# Altium schematic sheet MCU.SchDoc
size A2; SheetNumber: 3; SheetTotal: 12
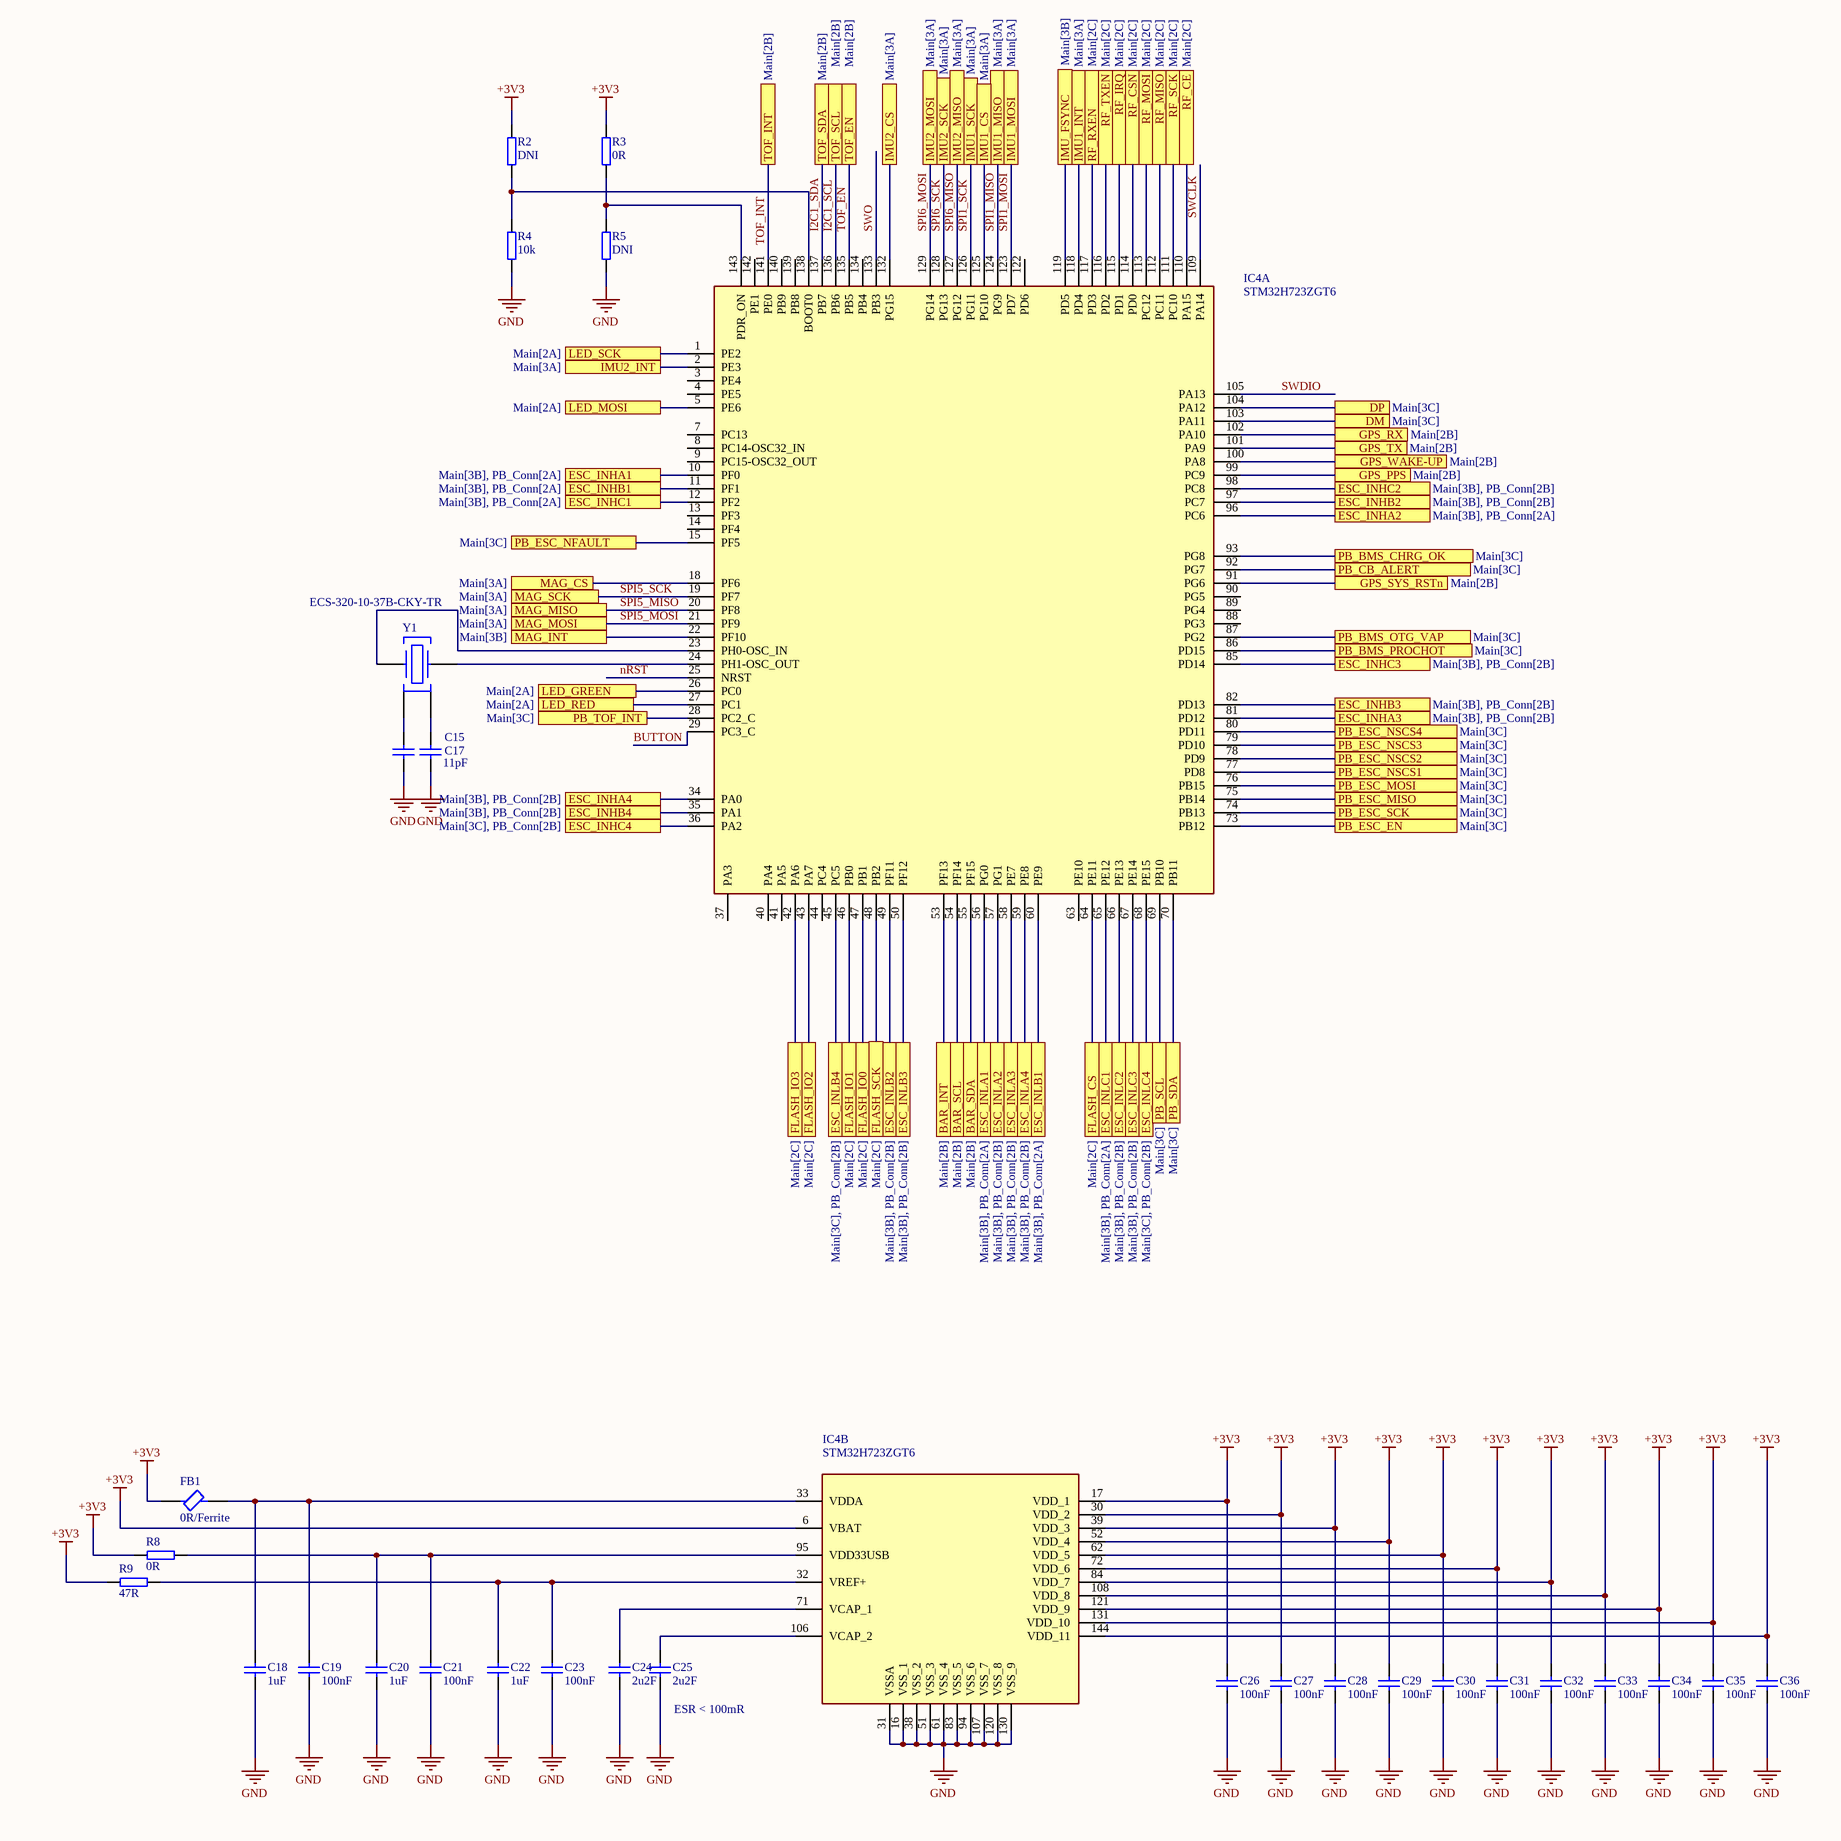
[diagram p0: MCU.SchDoc, left]
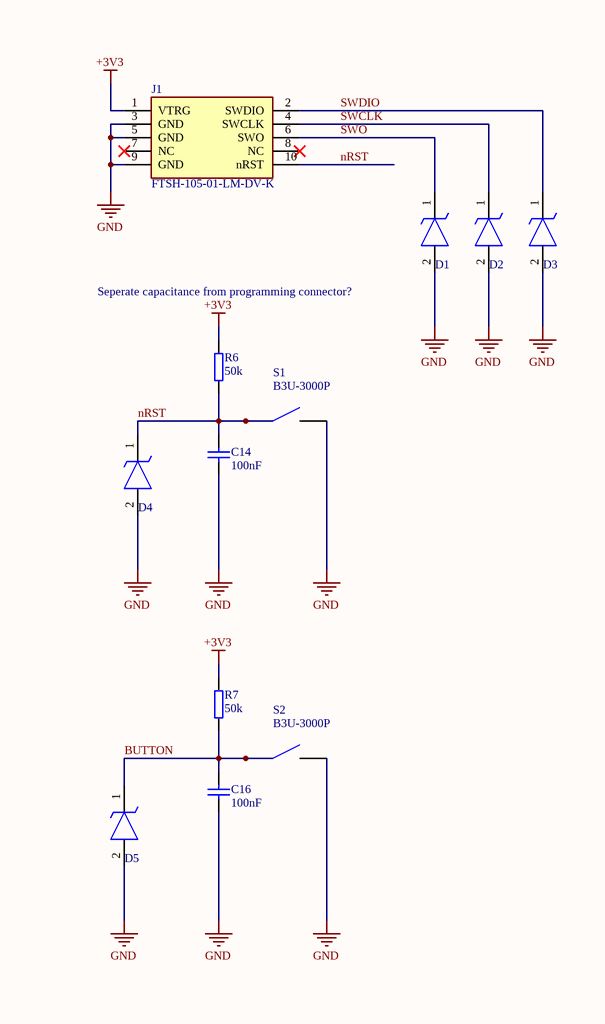
[diagram p1: MCU.SchDoc, right]

## Parts
C14  value 100nF  [CAP0402]  (hidden comment: Cap0402)
C15  Cap0402  [CAP0402]  (value not drawn)
C16  value 100nF  [CAP0402]  (hidden comment: Cap0402)
C17  value 11pF  [CAP0402]  (hidden comment: Cap0402)
C18  value 1uF  [CAP0603]  (hidden comment: Cap0603)
C19  value 100nF  [CAP0402]  (hidden comment: Cap0402)
C20  value 1uF  [CAP0603]  (hidden comment: Cap0603)
C21  value 100nF  [CAP0402]  (hidden comment: Cap0402)
C22  value 1uF  [CAP0603]  (hidden comment: Cap0603)
C23  value 100nF  [CAP0402]  (hidden comment: Cap0402)
C24  value 2u2F  [CAP0603]  (hidden comment: Cap0603)
C25  value 2u2F  [CAP0603]  (hidden comment: Cap0603)
C26  value 100nF  [CAP0402]  (hidden comment: Cap0402)
C27  value 100nF  [CAP0402]  (hidden comment: Cap0402)
C28  value 100nF  [CAP0402]  (hidden comment: Cap0402)
C29  value 100nF  [CAP0402]  (hidden comment: Cap0402)
C30  value 100nF  [CAP0402]  (hidden comment: Cap0402)
C31  value 100nF  [CAP0402]  (hidden comment: Cap0402)
C32  value 100nF  [CAP0402]  (hidden comment: Cap0402)
C33  value 100nF  [CAP0402]  (hidden comment: Cap0402)
C34  value 100nF  [CAP0402]  (hidden comment: Cap0402)
C35  value 100nF  [CAP0402]  (hidden comment: Cap0402)
C36  value 100nF  [CAP0402]  (hidden comment: Cap0402)
D1  D1213A-01LP4-7B  [D1213A01LP47B]  (value not drawn)
D2  D1213A-01LP4-7B  [D1213A01LP47B]  (value not drawn)
D3  D1213A-01LP4-7B  [D1213A01LP47B]  (value not drawn)
D4  D1213A-01LP4-7B  [D1213A01LP47B]  (value not drawn)
D5  D1213A-01LP4-7B  [D1213A01LP47B]  (value not drawn)
FB1  0R/Ferrite  [NFZ15SG152SN10B]
IC4  STM32H723ZGT6  [QFP50P2200X2200X160-144N]  (parts A,B of 2)
J1  FTSH-105-01-LM-DV-K  [FTSH-105-XX-YYY-DV-K]
R2  value DNI  [RES0402]  (hidden comment: Res0402)
R3  value 0R  [RES0402]  (hidden comment: Res0402)
R4  value 10k  [RES0402]  (hidden comment: Res0402)
R5  value DNI  [RES0402]  (hidden comment: Res0402)
R6  value 50k  [RES0402]  (hidden comment: Res0402)
R7  value 50k  [RES0402]  (hidden comment: Res0402)
R8  value 0R  [RES0402]  (hidden comment: Res0402)
R9  value 47R  [RES0402]  (hidden comment: Res0402)
S1  B3U-3000P  [B3U-1000P]
S2  B3U-3000P  [B3U-1000P]
Y1  ECS-320-10-37B-CKY-TR  [ECS3201037BCKYTR]

## Ports
BAR_INT (see Main[2B]), BAR_SCL (see Main[2B]), BAR_SDA (see Main[2B]), DM (see Main[3C]), DP (see Main[3C]), ESC_INHA1 (see Main[3B], PB_Conn[2A]), ESC_INHA2 (see Main[3B], PB_Conn[2A]), ESC_INHA3 (see Main[3B], PB_Conn[2B]), ESC_INHA4 (see Main[3B], PB_Conn[2B]), ESC_INHB1 (see Main[3B], PB_Conn[2A]), ESC_INHB2 (see Main[3B], PB_Conn[2B]), ESC_INHB3 (see Main[3B], PB_Conn[2B]), ESC_INHB4 (see Main[3B], PB_Conn[2B]), ESC_INHC1 (see Main[3B], PB_Conn[2A]), ESC_INHC2 (see Main[3B], PB_Conn[2B]), ESC_INHC3 (see Main[3B], PB_Conn[2B]), ESC_INHC4 (see Main[3C], PB_Conn[2B]), ESC_INLA1 (see Main[3B], PB_Conn[2A]), ESC_INLA2 (see Main[3B], PB_Conn[2B]), ESC_INLA3 (see Main[3B], PB_Conn[2B]), ESC_INLA4 (see Main[3B], PB_Conn[2B]), ESC_INLB1 (see Main[3B], PB_Conn[2A]), ESC_INLB2 (see Main[3B], PB_Conn[2B]), ESC_INLB3 (see Main[3B], PB_Conn[2B]), ESC_INLB4 (see Main[3C], PB_Conn[2B]), ESC_INLC1 (see Main[3B], PB_Conn[2A]), ESC_INLC2 (see Main[3B], PB_Conn[2B]), ESC_INLC3 (see Main[3B], PB_Conn[2B]), ESC_INLC4 (see Main[3C], PB_Conn[2B]), FLASH_CS (see Main[2C]), FLASH_IO0 (see Main[2C]), FLASH_IO1 (see Main[2C]), FLASH_IO2 (see Main[2C]), FLASH_IO3 (see Main[2C]), FLASH_SCK (see Main[2C]), GPS_PPS (see Main[2B]), GPS_RX (see Main[2B]), GPS_SYS_RSTn (see Main[2B]), GPS_TX (see Main[2B]), GPS_WAKE-UP (see Main[2B]), IMU1_CS (see Main[3A]), IMU1_INT (see Main[3A]), IMU1_MISO (see Main[3A]), IMU1_MOSI (see Main[3A]), IMU1_SCK (see Main[3A]), IMU2_CS (see Main[3A]), IMU2_INT (see Main[3A]), IMU2_MISO (see Main[3A]), IMU2_MOSI (see Main[3A]), IMU2_SCK (see Main[3A]), IMU_FSYNC (see Main[3B]), LED_GREEN (see Main[2A]), LED_MOSI (see Main[2A]), LED_RED (see Main[2A]), LED_SCK (see Main[2A]), MAG_CS (see Main[3A]), MAG_INT (see Main[3B]), MAG_MISO (see Main[3A]), MAG_MOSI (see Main[3A]), MAG_SCK (see Main[3A]), PB_BMS_CHRG_OK (see Main[3C]), PB_BMS_OTG_VAP (see Main[3C]), PB_BMS_PROCHOT (see Main[3C]), PB_CB_ALERT (see Main[3C]), PB_ESC_EN (see Main[3C]), PB_ESC_MISO (see Main[3C]), PB_ESC_MOSI (see Main[3C]), PB_ESC_NFAULT (see Main[3C]), PB_ESC_NSCS1 (see Main[3C]), PB_ESC_NSCS2 (see Main[3C]), PB_ESC_NSCS3 (see Main[3C]), PB_ESC_NSCS4 (see Main[3C]), PB_ESC_SCK (see Main[3C]), PB_SCL (see Main[3C]), PB_SDA (see Main[3C]), PB_TOF_INT (see Main[3C]), RF_CE (see Main[2C]), RF_CSN (see Main[2C]), RF_IRQ (see Main[2C]), RF_MISO (see Main[2C]), RF_MOSI (see Main[2C]), RF_RXEN (see Main[2C]), RF_SCK (see Main[2C]), RF_TXEN (see Main[2C]), TOF_EN (see Main[2B]), TOF_INT (see Main[2B]), TOF_SCL (see Main[2B]), TOF_SDA (see Main[2B])

## Nets
+3V3: C26.2 C27.2 C28.2 C29.2 C30.2 C31.2 C32.2 C33.2 C34.2 C35.2 C36.2 FB1.1 IC4.6(VBAT) IC4.17(VDD_1) IC4.30(VDD_2) IC4.39(VDD_3) IC4.52(VDD_4) IC4.62(VDD_5) IC4.72(VDD_6) IC4.84(VDD_7) IC4.108(VDD_8) IC4.121(VDD_9) IC4.131(VDD_10) IC4.144(VDD_11) J1.1(VTRG) R2.2 R3.2 R6.2 R7.2 R8.1 R9.1
GND: C14.1 C15.1 C16.1 C17.1 C18.1 C19.1 C20.1 C21.1 C22.1 C23.1 C24.1 C25.1 C26.1 C27.1 C28.1 C29.1 C30.1 C31.1 C32.1 C33.1 C34.1 C35.1 C36.1 D1.2(A) D2.2(A) D3.2(A) D4.2(A) D5.2(A) IC4.16(VSS_1) IC4.31(VSSA) IC4.38(VSS_2) IC4.51(VSS_3) IC4.61(VSS_4) IC4.83(VSS_5) IC4.94(VSS_6) IC4.107(VSS_7) IC4.120(VSS_8) IC4.130(VSS_9) J1.3(GND) J1.5(GND) J1.9(GND) R4.1 R5.1 S1.1 S2.1
BAR_INT: IC4.53(PF13) ; port BAR_INT
BAR_SCL: IC4.54(PF14) ; port BAR_SCL
BAR_SDA: IC4.55(PF15) ; port BAR_SDA
BUTTON: C16.2 D5.1(K) IC4.29(PC3_C) R7.1 S2.2
DM: IC4.103(PA11) ; port DM
DP: IC4.104(PA12) ; port DP
ESC_INHA1: IC4.10(PF0) ; port ESC_INHA1
ESC_INHA2: IC4.96(PC6) ; port ESC_INHA2
ESC_INHA3: IC4.81(PD12) ; port ESC_INHA3
ESC_INHA4: IC4.34(PA0) ; port ESC_INHA4
ESC_INHB1: IC4.11(PF1) ; port ESC_INHB1
ESC_INHB2: IC4.97(PC7) ; port ESC_INHB2
ESC_INHB3: IC4.82(PD13) ; port ESC_INHB3
ESC_INHB4: IC4.35(PA1) ; port ESC_INHB4
ESC_INHC1: IC4.12(PF2) ; port ESC_INHC1
ESC_INHC2: IC4.98(PC8) ; port ESC_INHC2
ESC_INHC3: IC4.85(PD14) ; port ESC_INHC3
ESC_INHC4: IC4.36(PA2) ; port ESC_INHC4
ESC_INLA1: IC4.56(PG0) ; port ESC_INLA1
ESC_INLA2: IC4.57(PG1) ; port ESC_INLA2
ESC_INLA3: IC4.58(PE7) ; port ESC_INLA3
ESC_INLA4: IC4.59(PE8) ; port ESC_INLA4
ESC_INLB1: IC4.60(PE9) ; port ESC_INLB1
ESC_INLB2: IC4.49(PF11) ; port ESC_INLB2
ESC_INLB3: IC4.50(PF12) ; port ESC_INLB3
ESC_INLB4: IC4.45(PC5) ; port ESC_INLB4
ESC_INLC1: IC4.65(PE12) ; port ESC_INLC1
ESC_INLC2: IC4.66(PE13) ; port ESC_INLC2
ESC_INLC3: IC4.67(PE14) ; port ESC_INLC3
ESC_INLC4: IC4.68(PE15) ; port ESC_INLC4
FLASH_CS: IC4.64(PE11) ; port FLASH_CS
FLASH_IO0: IC4.47(PB1) ; port FLASH_IO0
FLASH_IO1: IC4.46(PB0) ; port FLASH_IO1
FLASH_IO2: IC4.43(PA7) ; port FLASH_IO2
FLASH_IO3: IC4.42(PA6) ; port FLASH_IO3
FLASH_SCK: IC4.48(PB2) ; port FLASH_SCK
GPS_PPS: IC4.99(PC9) ; port GPS_PPS
GPS_RX: IC4.102(PA10) ; port GPS_RX
GPS_SYS_RSTn: IC4.91(PG6) ; port GPS_SYS_RSTn
GPS_TX: IC4.101(PA9) ; port GPS_TX
GPS_WAKE-UP: IC4.100(PA8) ; port GPS_WAKE-UP
I2C1_SCL: IC4.136(PB6) ; port TOF_SCL
I2C1_SDA: IC4.137(PB7) ; port TOF_SDA
IMU1_CS: IC4.125(PG10) ; port IMU1_CS
IMU1_INT: IC4.118(PD4) ; port IMU1_INT
IMU2_CS: IC4.132(PG15) ; port IMU2_CS
IMU2_INT: IC4.2(PE3) ; port IMU2_INT
IMU_FSYNC: IC4.119(PD5) ; port IMU_FSYNC
LED_GREEN: IC4.26(PC0) ; port LED_GREEN
LED_MOSI: IC4.5(PE6) ; port LED_MOSI
LED_RED: IC4.27(PC1) ; port LED_RED
LED_SCK: IC4.1(PE2) ; port LED_SCK
MAG_CS: IC4.18(PF6) ; port MAG_CS
MAG_INT: IC4.22(PF10) ; port MAG_INT
nRST: C14.2 D4.1(K) IC4.25(NRST) J1.10(nRST) R6.1 S1.2
PB_BMS_CHRG_OK: IC4.93(PG8) ; port PB_BMS_CHRG_OK
PB_BMS_OTG_VAP: IC4.87(PG2) ; port PB_BMS_OTG_VAP
PB_BMS_PROCHOT: IC4.86(PD15) ; port PB_BMS_PROCHOT
PB_CB_ALERT: IC4.92(PG7) ; port PB_CB_ALERT
PB_ESC_EN: IC4.73(PB12) ; port PB_ESC_EN
PB_ESC_MISO: IC4.75(PB14) ; port PB_ESC_MISO
PB_ESC_MOSI: IC4.76(PB15) ; port PB_ESC_MOSI
PB_ESC_NFAULT: IC4.15(PF5) ; port PB_ESC_NFAULT
PB_ESC_NSCS1: IC4.77(PD8) ; port PB_ESC_NSCS1
PB_ESC_NSCS2: IC4.78(PD9) ; port PB_ESC_NSCS2
PB_ESC_NSCS3: IC4.79(PD10) ; port PB_ESC_NSCS3
PB_ESC_NSCS4: IC4.80(PD11) ; port PB_ESC_NSCS4
PB_ESC_SCK: IC4.74(PB13) ; port PB_ESC_SCK
PB_SCL: IC4.69(PB10) ; port PB_SCL
PB_SDA: IC4.70(PB11) ; port PB_SDA
PB_TOF_INT: IC4.28(PC2_C) ; port PB_TOF_INT
RF_CE: IC4.110(PA15) ; port RF_CE
RF_CSN: IC4.114(PD0) ; port RF_CSN
RF_IRQ: IC4.115(PD1) ; port RF_IRQ
RF_MISO: IC4.112(PC11) ; port RF_MISO
RF_MOSI: IC4.113(PC12) ; port RF_MOSI
RF_RXEN: IC4.117(PD3) ; port RF_RXEN
RF_SCK: IC4.111(PC10) ; port RF_SCK
RF_TXEN: IC4.116(PD2) ; port RF_TXEN
SPI1_MISO: IC4.124(PG9) ; port IMU1_MISO
SPI1_MOSI: IC4.123(PD7) ; port IMU1_MOSI
SPI1_SCK: IC4.126(PG11) ; port IMU1_SCK
SPI5_MISO: IC4.20(PF8) ; port MAG_MISO
SPI5_MOSI: IC4.21(PF9) ; port MAG_MOSI
SPI5_SCK: IC4.19(PF7) ; port MAG_SCK
SPI6_MISO: IC4.127(PG12) ; port IMU2_MISO
SPI6_MOSI: IC4.129(PG14) ; port IMU2_MOSI
SPI6_SCK: IC4.128(PG13) ; port IMU2_SCK
SWCLK: D2.1(K) IC4.109(PA14) J1.4(SWCLK)
SWDIO: D3.1(K) IC4.105(PA13) J1.2(SWDIO)
SWO: D1.1(K) IC4.133(PB3) J1.6(SWO)
TOF_EN: IC4.135(PB5) ; port TOF_EN
TOF_INT: IC4.141(PE0) ; port TOF_INT
NetC15_2: C15.2 Y1.4(GND_2)
NetC17_2: C17.2 Y1.2(GND_1)
NetC18_2: C18.2 C19.2 FB1.2 IC4.33(VDDA)
NetC20_2: C20.2 C21.2 IC4.95(VDD33USB) R8.2
NetC22_2: C22.2 C23.2 IC4.32(VREF+) R9.2
NetC24_2: C24.2 IC4.71(VCAP_1)
NetC25_2: C25.2 IC4.106(VCAP_2)
NetIC4_23: IC4.23(PH0-OSC_IN) Y1.1(CRYSTAL_1)
NetIC4_24: IC4.24(PH1-OSC_OUT) Y1.3(CRYSTAL_2)
NetIC4_138: IC4.138(BOOT0) R2.1 R4.2
NetIC4_143: IC4.143(PDR_ON) R3.1 R5.2

Not connected (* = marked no-connect by the designer): IC4 3(PE4) 4(PE5) 7(PC13) 8(PC14-OSC32_IN) 9(PC15-OSC32_OUT) 13(PF3) 14(PF4) 37(PA3) 40(PA4) 41(PA5) 44(PC4) 63(PE10) 88(PG3) 89(PG4) 90(PG5) 122(PD6) 134(PB4) 139(PB8) 140(PB9) 142(PE1); J1 7(NC)* 8(NC)*

## Notes on the sheet
- Seperate capacitance from programming connector?
- (near C25) ESR < 100mR

## Library data of the parts
C14 C16 C17 C19 C21 C23 C26-C36 = Cap0402: Voltage: 50V
C15 = Cap0402: Voltage: 50V; Value: 11pF
C18 C20 C22 C24 C25 = Cap0603: Voltage: 50V
D1-D5 = D1213A-01LP4-7B: TVS Diode (Uni-directional); Manufacturer_Name: Diodes Incorporated; Datasheet Link: https://www.diodes.com/assets/Datasheets/D1213A-01LP4.pdf; Height: 0.4mm; Manufacturer_Part_Number: D1213A-01LP4-7B; Mouser Part Number: 621-D1213A-01LP4-7B; Mouser Price/Stock: https://www.mouser.co.uk/ProductDetail/Diodes-Incorporated/D1213A-01LP4-7B?qs=gfe7vQ8txpVKfG5NOSOvfA%3D%3D; Arrow Part Number: D1213A-01LP4-7B; Arrow Price/Stock: https://www.arrow.com/en/products/d1213a-01lp4-7b/diodes-incorporated?region=europe
FB1 = BLM15PE471SH1D: Ferrite Bead; Manufacturer_Name: Murata Electronics; Datasheet Link: https://www.murata.com/en-global/products/productdetail.aspx?cate=luNoiseSupprFilteChipFerriBead&partno=BLM15PE471SH1%23; Height: 0.55mm; Manufacturer_Part_Number: BLM15PE471SH1D; Mouser Part Number: 81-BLM15PE471SH1D; Mouser Price/Stock: https://www.mouser.co.uk/ProductDetail/Murata-Electronics/BLM15PE471SH1D?qs=DRkmTr78QATAY5qAVx1hGA%3D%3D
IC4 = STM32H723ZGT6: Integrated Circuit; Manufacturer_Name: STMicroelectronics; Datasheet Link: https://www.mouser.cn/datasheet/2/389/stm32h723zg-1893346.pdf; Height: 1.6mm; Manufacturer_Part_Number: STM32H723ZGT6; Mouser Part Number: 511-STM32H723ZGT6; Mouser Price/Stock: https://www.mouser.co.uk/ProductDetail/STMicroelectronics/STM32H723ZGT6?qs=sPbYRqrBIVkPaOxQT7wG%252BA%3D%3D; Arrow Part Number: STM32H723ZGT6; Arrow Price/Stock: https://www.arrow.com/en/products/stm32h723zgt6/stmicroelectronics?region=nac
J1 = FTSH-105-01-LM-DV-K: Connector; Manufacturer_Name: SAMTEC; Datasheet Link: http://suddendocs.samtec.com/prints/ftsh-1xx-xx-xxx-dv-xxx-xxx-mkt.pdf; Manufacturer_Part_Number: FTSH-105-01-LM-DV-K; Mouser Part Number: 200-FTSH10501LMDVK; Mouser Price/Stock: https://www.mouser.co.uk/ProductDetail/Samtec/FTSH-105-01-LM-DV-K?qs=Cqqh%252BS766wkgt1n7b4Yb6g%3D%3D; Arrow Part Number: FTSH-105-01-LM-DV-K; Arrow Price/Stock: https://www.arrow.com/en/products/ftsh-105-01-lm-dv-k/samtec?utm_currency=USD&region=nac
S1 S2 = B3U-3000P: Switch; Manufacturer_Name: Omron Electronics; Datasheet Link: http://omronfs.omron.com/en_US/ecb/products/pdf/en-b3u.pdf; Manufacturer_Part_Number: B3U-3000P; Mouser Part Number: 653-B3U-3000P; Mouser Price/Stock: https://www.mouser.co.uk/ProductDetail/Omron-Electronics/B3U-3000P?qs=AO7BQMcsEu4un9I7hS23xg%3D%3D; Arrow Part Number: B3U-3000P; Arrow Price/Stock: https://www.arrow.com/en/products/b3u-3000p/omron?region=nac
Y1 = ECS-320-10-37B-CKY-TR: Crystal or Oscillator; Manufacturer_Name: ECS; Datasheet Link: https://ecsxtal.com/store/pdf/ECX-1637B.pdf; Height: 0.5mm; Manufacturer_Part_Number: ECS-320-10-37B-CKY-TR; Mouser Part Number: 520-320-10-37B-CKYT; Mouser Price/Stock: https://www.mouser.co.uk/ProductDetail/ECS/ECS-320-10-37B-CKY-TR?qs=l7cgNqFNU1gltxVt%2FwcX%252Bw%3D%3D; Arrow Part Number: ECS-320-10-37B-CKY-TR; Arrow Price/Stock: https://www.arrow.com/en/products/ecs-320-10-37b-cky-tr/ecs-international?region=nac